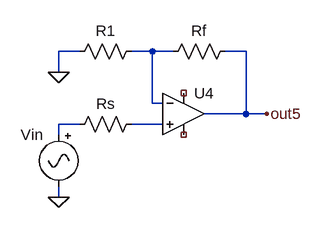
[diagram p0: schematic discrete-opamp3-fig4.asc]
discrete-opamp3-fig4.asc, the LTspice schematic file:
Version 4
SHEET 1 3556 680
WIRE 3200 0 3168 0
WIRE 3312 0 3280 0
WIRE 3344 0 3312 0
WIRE 3456 0 3424 0
WIRE 3168 32 3168 0
WIRE 3312 80 3312 0
WIRE 3328 80 3312 80
WIRE 3456 96 3456 0
WIRE 3456 96 3392 96
WIRE 3488 96 3456 96
WIRE 3200 112 3168 112
WIRE 3328 112 3280 112
WIRE 3168 128 3168 112
WIRE 3168 224 3168 208
FLAG 3488 96 out5
FLAG 3168 224 0
FLAG 3168 32 0
SYMBOL Opamps\\UniversalOpamp2 3360 96 R0
SYMATTR InstName U4
SYMBOL res 3296 96 R90
WINDOW 0 0 56 VBottom 2
WINDOW 3 32 56 VTop 2
SYMATTR InstName Rs
SYMATTR Value ""
SYMBOL Misc\\signal 3168 112 M0
SYMATTR InstName Vin
SYMATTR Value ""
SYMBOL res 3440 -16 R90
WINDOW 0 0 56 VBottom 2
WINDOW 3 32 56 VTop 2
SYMATTR InstName Rf
SYMATTR Value ""
SYMBOL res 3296 -16 R90
WINDOW 0 0 56 VBottom 2
WINDOW 3 32 56 VTop 2
SYMATTR InstName R1
SYMATTR Value ""

The netlist it stands for:
* discrete-opamp3-fig4.asc
XU4 N003 N001 NC_01 NC_02 out5 level.2 Avol=1Meg GBW=10Meg Slew=10Meg ilimit=25m rail=0 Vos=0 phimargin=45 en=0 enk=0 in=0 ink=0 Rin=500Meg  ; pins IN+ IN- V+ V- OUT
Rs N003 N002
Vin N002 0
Rf out5 N001
R1 N001 0
.lib UniversalOpamps2.sub
.backanno
.end